# Altium schematic sheet MCU.SchDoc
size A4 portrait; Address1: 00-<Schema Name>; DocumentNumber: 2; SheetNumber: 2; SheetTotal: 5; ModifiedBy: -; Size: A4
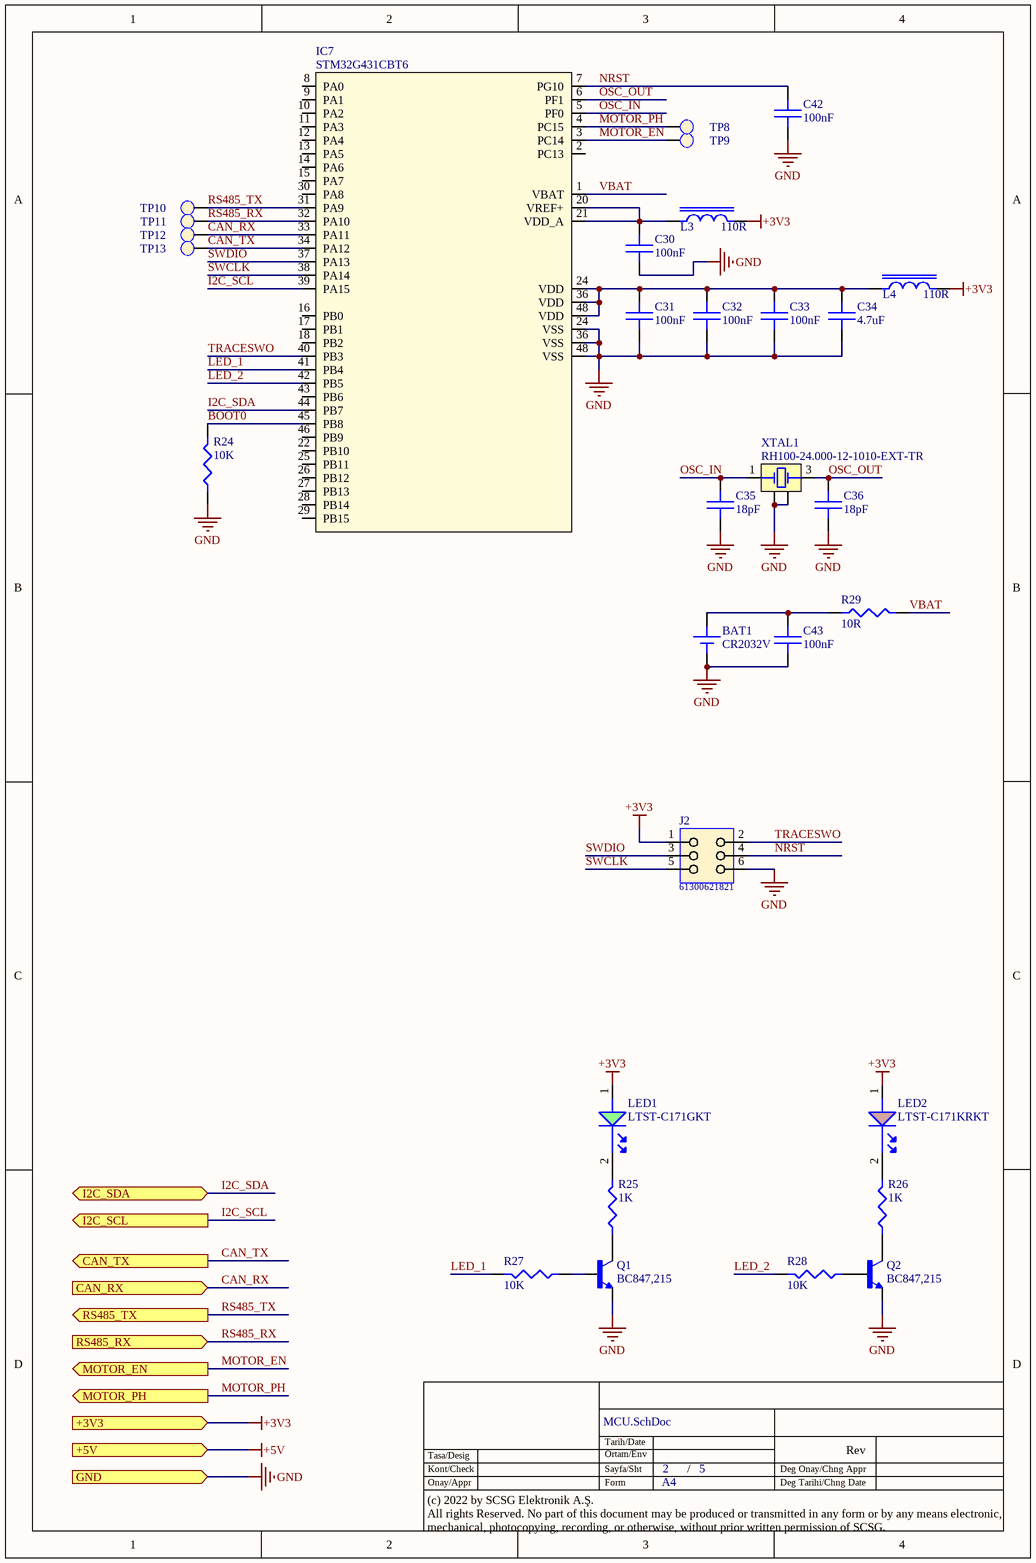
[diagram p0: MCU.SchDoc]

## Parts
BAT1  CR2032V  [CR2032V]
C30  100nF  [C0402]
C31  100nF  [C0402]
C32  100nF  [C0402]
C33  100nF  [C0402]
C34  4.7uF  [C0603]
C35  18pF  [C0402]
C36  18pF  [C0402]
C42  100nF  [C0402]
C43  100nF  [C0402]
IC7  STM32G431CBT6  [LQFP48-7x7mm]
J2  61300621821  [61300621821]
L3  110R  [L0402]
L4  110R  [L0402]
LED1  LTST-C171GKT  [0805_green]
LED2  LTST-C171KRKT  [0805_RED]
Q1  BC847,215  [SOT23-3]
Q2  BC847,215  [SOT23-3]
R24  10K  [R0402]
R25  1K  [R0402]
R26  1K  [R0402]
R27  10K  [R0402]
R28  10K  [R0402]
R29  10R  [R0402]
TP8  TestPoint1  [SMD_1mmPoint]  (value not drawn)  (no BOM)
TP9  TestPoint1  [SMD_1mmPoint]  (value not drawn)  (no BOM)
TP10  TestPoint1  [SMD_1mmPoint]  (value not drawn)  (no BOM)
TP11  TestPoint1  [SMD_1mmPoint]  (value not drawn)  (no BOM)
TP12  TestPoint1  [SMD_1mmPoint]  (value not drawn)  (no BOM)
TP13  TestPoint1  [SMD_1mmPoint]  (value not drawn)  (no BOM)
XTAL1  RH100-24.000-12-1010-EXT-TR  [WE-XTAL_CFPX-180]

## Ports
+3V3 (in), +5V (in), CAN_RX (in), CAN_TX (out), GND (in), I2C_SCL (out), I2C_SDA (bidir), MOTOR_EN (out), MOTOR_PH (out), RS485_RX (in), RS485_TX (out)

## Nets
+3V3: J2.1 L3.2 L4.2 LED1.1 LED2.1 ; port +3V3
+5V: port +5V
GND: BAT1.2 C30.1 C31.1 C32.1 C33.1 C34.1 C35.1 C36.1 C42.1 C43.1 IC7.24(VSS) IC7.36(VSS) IC7.48(VSS) J2.6 Q1.2(E) Q2.2(E) R24.1 XTAL1.2(GND_&_Lid) XTAL1.4(GND_&_Lid) ; port GND
BOOT0: IC7.45(PB8) R24.2
CAN_RX: IC7.33(PA11) TP12.1 ; port CAN_RX
CAN_TX: IC7.34(PA12) TP13.1 ; port CAN_TX
I2C_SCL: IC7.39(PA15) ; port I2C_SCL
I2C_SDA: IC7.44(PB7) ; port I2C_SDA
LED_1: IC7.41(PB4) R27.2
LED_2: IC7.42(PB5) R28.2
MOTOR_EN: IC7.3(PC14) TP9.1 ; port MOTOR_EN
MOTOR_PH: IC7.4(PC15) TP8.1 ; port MOTOR_PH
NRST: C42.2 IC7.7(PG10) J2.4
OSC_IN: C35.2 IC7.5(PF0) XTAL1.1(Crystal)
OSC_OUT: C36.2 IC7.6(PF1) XTAL1.3(Crystal)
RS485_RX: IC7.32(PA10) TP11.1 ; port RS485_RX
RS485_TX: IC7.31(PA9) TP10.1 ; port RS485_TX
SWCLK: IC7.38(PA14) J2.5
SWDIO: IC7.37(PA13) J2.3
TRACESWO: IC7.40(PB3) J2.2
VBAT: IC7.1(VBAT) R29.2
NetBAT1_1: BAT1.1 C43.2 R29.1
NetC30_2: C30.2 IC7.20(VREF+) IC7.21(VDD_A) L3.1
NetC31_2: C31.2 C32.2 C33.2 C34.2 IC7.24(VDD) IC7.36(VDD) IC7.48(VDD) L4.1
NetLED1_2: LED1.2 R25.2
NetLED2_2: LED2.2 R26.2
NetQ1_1: Q1.1(B) R27.1
NetQ1_3: Q1.3(C) R25.1
NetQ2_1: Q2.1(B) R28.1
NetQ2_3: Q2.3(C) R26.1

Not connected (* = marked no-connect by the designer): IC7 2(PC13) 8(PA0) 9(PA1) 10(PA2) 11(PA3) 12(PA4) 13(PA5) 14(PA6) 15(PA7) 16(PB0) 17(PB1) 18(PB2) 22(PB10) 25(PB11) 26(PB12) 27(PB13) 28(PB14) 29(PB15) 30(PA8) 43(PB6) 46(PB9)

## Notes on the sheet
- Tarih/Date
- Tasa/Desig
- Kont/Check
- Onay/Appr
- Sayfa/Sht
- Form
- Ortam/Env
- A4
- /
- Deg Tarihi/Chng Date
- Deg Onay/Chng Appr
- Rev
- (c) 2022 by SCSG Elektronik A.Ş.
  All rights Reserved. No part of this document may be produced or transmitted in any form or by any means electronic, mechanical, photocopying, recording, or otherwise, without prior written permission of SCSG.

## Library data of the parts
BAT1 = CR2032-PEN3-A10606: CR2032 Dikey Montaj; Manufacturer: EEMB; Purpose Of Usage: RTC; Category: BATTERY; Manufacturer Part Number: CR2032-PEN3-A10606; Supplier 1: Ozdisan; Mount: THT; Sub-Category: COIN CELL; Supplier Part Number 1: CR2032-PEN3-A10606; Stock ID: ??
C30-C33 C42 = CC0402KRX7R6BB104: 100nF ,10V ,X7R ,0402; Manufacturer: Yageo; Value: 100000; Tolerance: 10%; Dielectric Material: Ceramic; Purpose Of Usage: BASIC; Supplier 1: Digi-Key; Manufacturer Part Number: CC0402KRX7R6BB104; RoHS: YES; Category: CAPASITOR; Mount: SMD; Case/Package: 0402; Case Code (Imperial): 0402; Case Code (Metric): 1005; Min Operating Temperature: -55°C; Max Operating Temperature: 125°C; Voltage Rating: 10V; Voltage Rating (DC): 10V; Dielectric: X7R; Height: 0.5mm; Supplier Part Number 1: 311-1345-1-ND; Sub-Category: CERAMIC; Stock ID: ??; Local Supplier: GENERAL; Price 10K: 0.00250
C34 = CC0603MRX7R5BB475: 4.7uF, 6.3V, X7R, 0603; Manufacturer: Yageo; Value: 4700000; Tolerance: 20%; Dielectric Material: Ceramic; Purpose Of Usage: BASIC; Supplier 1: Digi-Key; Supplier Part Number 1: 311-3496-6-ND; Manufacturer Part Number: CC0603MRX7R5BB475; RoHS: YES; Mount: SMD; Case/Package: 0603; Case Code (Imperial): 0603; Case Code (Metric): 1608; Min Operating Temperature: -55°C; Max Operating Temperature: 125°C; Voltage Rating: 6.3V; Category: CAPASITOR; Sub-Category: CERAMIC; Dielectric: X7R; Stock ID: ??; Voltage Rating (DC): 6.3V; Local Supplier: GENERAL; Price 10K: 0.00250
C35 C36 = CC0402JRNPO9BN180: 18pF, 50V, C0G, 0402; Manufacturer: Yageo; Value: 18; Tolerance: 5%; Temperature Coefficient: 30ppm/°C; Dielectric Material: Ceramic; Purpose Of Usage: BASIC; Supplier 1: Digi-Key; Manufacturer Part Number: CC0402JRNPO9BN180; RoHS: YES; Category: CAPASITOR; Mount: SMD; Case/Package: 0402; Case Code (Metric): 1005; Case Code (Imperial): 0402; Min Operating Temperature: -55°C; Max Operating Temperature: 125°C; Voltage Rating: 50V; Voltage Rating (DC): 50V; Dielectric: C0G; Height: 0.5mm; Supplier Part Number 1: 311-1415-1-ND; Sub-Category: CERAMIC; Stock ID: ??; Local Supplier: GENERAL; Price 10K: 0.00250
C43 = CC0402KRX7R6BB104: 100nF ,10V ,X7R ,0402; Manufacturer: Yageo; Value: 100000; Tolerance: 10%; Dielectric Material: Ceramic; Purpose Of Usage: RTC; Supplier 1: Digi-Key; Manufacturer Part Number: CC0402KRX7R6BB104; RoHS: YES; Category: CAPASITOR; Mount: SMD; Case/Package: 0402; Case Code (Imperial): 0402; Case Code (Metric): 1005; Min Operating Temperature: -55°C; Max Operating Temperature: 125°C; Voltage Rating: 10V; Voltage Rating (DC): 10V; Dielectric: X7R; Height: 0.5mm; Supplier Part Number 1: 311-1345-1-ND; Sub-Category: CERAMIC; Stock ID: ??; Local Supplier: GENERAL; Price 10K: 0.00250
IC7 = STM32G431CBT6: MCU 32-bit ARM Cortex M4 RISC 128KB Flash 1.8V/2.5V/3.3V 48-Pin LQFP Tray; Manufacturer: STMicroelectronics; Max Supply Voltage: 3.6V; Min Supply Voltage: 1.62V; Purpose Of Usage: BASIC; Manufacturer Part Number: STM32G431CBT6; RoHS: Yes; Category: INTEGRATED CIRCUITS; Case/Package: LQFP; Lead Free: Lead Free; Max Operating Temperature: 85°C; Min Operating Temperature: -40°C; Mount: SMD; Stock ID: ??; Sub-Category: MCU; Supplier 1: Digi-Key; Supplier Part Number 1: 497-19473-ND
J2 = 61300621821: Socket Header, THT, pitch 2.54mm, Dual Row, Vertical, 6pin; Manufacturer: Wurth Electronics; Gender: Female; Purpose Of Usage: BASIC; Manufacturer Part Number: 61300621821; Pitch: 2.54mm; Orientation: Vertical; Category: CONNECTORS; Sub-Category: SOCKET HEADER; Supplier 1: Digi-Key; Supplier Part Number 1: 732-61300621821-ND; Stock ID: ??
L3 L4 = 74269242111: Ferrite Bead, 0.09 Ohm, 1.2A, 0402;; Manufacturer: Wurth Electronics; Purpose Of Usage: BASIC; Supplier 1: Digi-Key; Manufacturer Part Number: 74269242111; RoHS: NO; Category: INDUCTORS; Stock 1: 18401; Supplier Part Number 1: 732-74269242111CT-ND; Case/Package: 0402; Mount: SMD; Stock ID: ??; Sub-Category: FERRITE BEADS
LED1 = LTST-C171GKT: LED GREEN CLEAR CHIP SMD; Manufacturer: Vishay Lite-On; Supplier 1: Digi-Key; Supplier Part Number 1: 160-1423-1-ND; Manufacturer Part Number: LTST-C171GKT; RoHS: YES; Mount: SMD; Case/Package: 0805; Color: Green; Min Operating Temperature: -55°C; Max Operating Temperature: 85°C; Category: DIODE; Sub-Category: LED; Stock ID: ??; Purpose Of Usage: LED
LED2 = LTST-C171KRKT: LED RED CLEAR SMD; Manufacturer: Vishay Lite-On; Supplier 1: Digi-Key; Supplier Part Number 1: 160-1427-1-ND; Manufacturer Part Number: LTST-C171KRKT; RoHS: YES; Mount: SMD; Case/Package: 0805; Color: Red; Min Operating Temperature: -55°C; Max Operating Temperature: 85°C; Category: DIODE; Sub-Category: LED; Stock ID: ??; Purpose Of Usage: LED
Q1 Q2 = BC847,215: TRANS NPN 45V 0.1A SOT23; Manufacturer: Nexperia; Purpose Of Usage: LED; Supplier 1: Digi-Key; Supplier Part Number 1: 1727-4855-1-ND; Manufacturer Part Number: BC847,215; RoHS: No; Category: BJT; Case/Package: SOT-23-3; Max Operating Temperature: 150°C; Min Operating Temperature: -55°C; Mount: SMD; Sub-Category: NPN; Stock ID: ??; Price 10K: 0.021; Local Supplier: OZDISAN
R24 = RC0402FR-0710KL: 10K, %1, 1/16W, 0402; Manufacturer: YAGEO; Voltage Rating: 50V; Value: 10000; Power Rating: 63mW; Tolerance: 1%; Temperature Coefficient: 100ppm/°C; Purpose Of Usage: BASIC; Supplier 1: Digi-Key; Manufacturer Part Number: RC0402FR-0710KL; RoHS: YES; Category: RESISTOR; Case/Package: 0402; Case Code (Imperial): 0402; Min Operating Temperature: -55°C; Max Operating Temperature: 155°C; Max Power Dissipation: 63mW; Voltage Rating (DC): 50V; Working Voltage: 50V; Supplier Part Number 1: 311-10.0KLRCT-ND; Stock ID: ??; Mount: SMD; Sub-Category: CHIP RESISTOR; Price 10K: 0.0025; Local Supplier: GENERAL
R25 R26 = RC0402FR-071KL: 1K, %1, 1/16W, 0402; Manufacturer: YAGEO; Tolerance: 1%; Value: 1000; Temperature Coefficient: 100ppm/°C; Power Rating: 63mW; Voltage Rating: 50V; Purpose Of Usage: LED; Supplier 1: Digi-Key; Manufacturer Part Number: RC0402FR-071KL; RoHS: YES; Category: RESISTOR; Case/Package: 0402; Case Code (Imperial): 0402; Min Operating Temperature: -55°C; Max Operating Temperature: 155°C; Voltage Rating (DC): 50V; Max Power Dissipation: 63mW; Supplier Part Number 1: 311-1.00KLRCT-ND; Stock ID: ??; Mount: SMD; Sub-Category: CHIP RESISTOR; Price 10K: 0.0025; Local Supplier: GENERAL
R27 R28 = RC0402FR-0710KL: 10K, %1, 1/16W, 0402; Manufacturer: YAGEO; Voltage Rating: 50V; Value: 10000; Power Rating: 63mW; Tolerance: 1%; Temperature Coefficient: 100ppm/°C; Purpose Of Usage: LED; Supplier 1: Digi-Key; Manufacturer Part Number: RC0402FR-0710KL; RoHS: YES; Category: RESISTOR; Case/Package: 0402; Case Code (Imperial): 0402; Min Operating Temperature: -55°C; Max Operating Temperature: 155°C; Max Power Dissipation: 63mW; Voltage Rating (DC): 50V; Working Voltage: 50V; Supplier Part Number 1: 311-10.0KLRCT-ND; Stock ID: ??; Mount: SMD; Sub-Category: CHIP RESISTOR; Price 10K: 0.0025; Local Supplier: GENERAL
R29 = RC0402FR-0710RL: 10R, %1, 1/16W, 0402; Manufacturer: YAGEO; Tolerance: 1%; Power Rating: 62.5mW; Voltage Rating: 50V; Value: 10; Temperature Coefficient: 200ppm/°C; Max Power Dissipation: 63mW; Purpose Of Usage: RTC; Supplier 1: Digi-Key; Manufacturer Part Number: RC0402FR-0710RL; RoHS: YES; Category: RESISTOR; Case/Package: 0402; Case Code (Imperial): 0402; Min Operating Temperature: -55°C; Max Operating Temperature: 155°C; Working Voltage: 50V; Supplier Part Number 1: 311-10.0LRTR-ND; Local Supplier: GENERAL; Mount: SMD; Price 10K: 0.0025; Stock ID: ??; Sub-Category: CHIP RESISTOR; Voltage Rating (DC): 50V
TP8-TP13 = TestPoint1: test ölçüm noktası; Manufacturer: NO BOM DEVICE; Purpose Of Usage: BASIC; Category: CONNECTORS; Sub-Category: TEST POINT; Manufacturer Part Number: NO BOM DEVICE; Stock ID: ??
XTAL1 = RH100-24.000-12-1010-EXT-TR: Crystal, 24Mhz, 12Pf, Smd, 3.2Mm X 2.5Mm Rohs Compliant: Yes |Raltron RH100-24.000-12-1010-EXT-TR; Manufacturer: Raltron Electronics; Value: 24000000; Purpose Of Usage: BASIC; Supplier: Digikey; Supplier Part Number 1: 2151-RH100-24.000-12-1010-EXT-TRCT-ND; Manufacturer Part Number: RH100-24.000-12-1010-EXT-TR; RoHS: No; Category: OSCILATOR; Stock: 6000; Case/Package: 3.2 x 2.4; Max Operating Temperature: +85; Min Operating Temperature: -40; Mount: SMD; Stock ID: ??; Sub-Category: CRYSTAL; Supplier 1: Digi-Key